# Altium schematic sheet TMP116.SchDoc
size A4
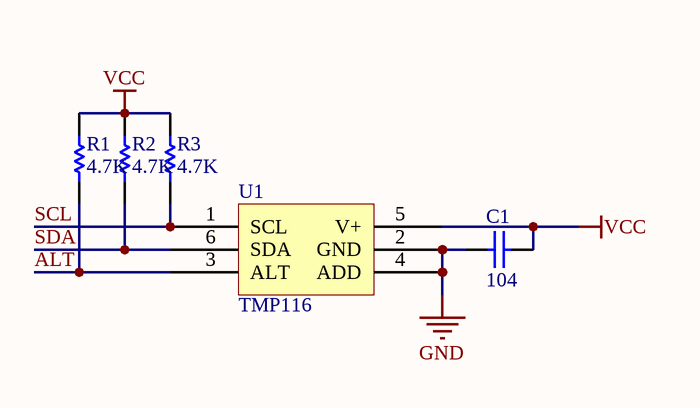
[diagram p0: TMP116.SchDoc]

## Parts
C1  value 104  [0402]  (hidden comment: Cap Semi)
R1  value 4.7K  [0402]  (hidden comment: Res1)
R2  value 4.7K  [0402]  (hidden comment: Res1)
R3  value 4.7K  [0402]  (hidden comment: Res1)
U1  value TMP116  [WSON]  (hidden comment: Sensor)

## Nets
GND: C1.1 U1.2(GND) U1.4(ADD)
VCC: C1.2 R1.1 R2.1 R3.1 U1.5(V+)
ALT: R1.2 U1.3(ALT)
SCL: R3.2 U1.1(SCL)
SDA: R2.2 U1.6(SDA)

## Library data of the parts
C1 = Cap Semi: Capacitor (Semiconductor SIM Model); Published: 8-Jun-2000; LatestRevisionDate: 17-Jul-2002; LatestRevisionNote: Re-released for DXP Platform.; PackageReference: C1206; Publisher: Altium Limited
R1-R3 = Res1: Resistor; Published: 8-Jun-2000; LatestRevisionDate: 17-Jul-2002; LatestRevisionNote: Re-released for DXP Platform.; PackageReference: AXIAL-0.3; Publisher: Altium Limited
U1 = TMP116